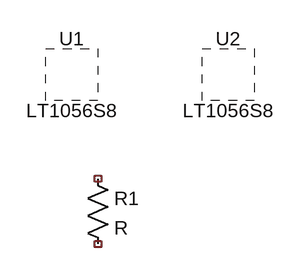
[diagram p0: schematic ranmp-generator-555.asc]
ranmp-generator-555.asc, the LTspice schematic file:
Version 4
SHEET 1 880 680
SYMBOL Opamps\\LT1056S8 176 80 R0
SYMATTR InstName U1
SYMBOL Opamps\\LT1056S8 368 80 R0
SYMATTR InstName U2
SYMBOL res 192 192 R0
SYMATTR InstName R1

The netlist it stands for:
* ranmp-generator-555.asc
* U1: LT1056S8 (symbol Opamps\LT1056S8 not available, pin order unknown); nets seen at it: 
* U2: LT1056S8 (symbol Opamps\LT1056S8 not available, pin order unknown); nets seen at it: 
R1 NC_01 NC_02 R
.backanno
.end